# Altium schematic sheet 原理图 .SchDoc
size A4
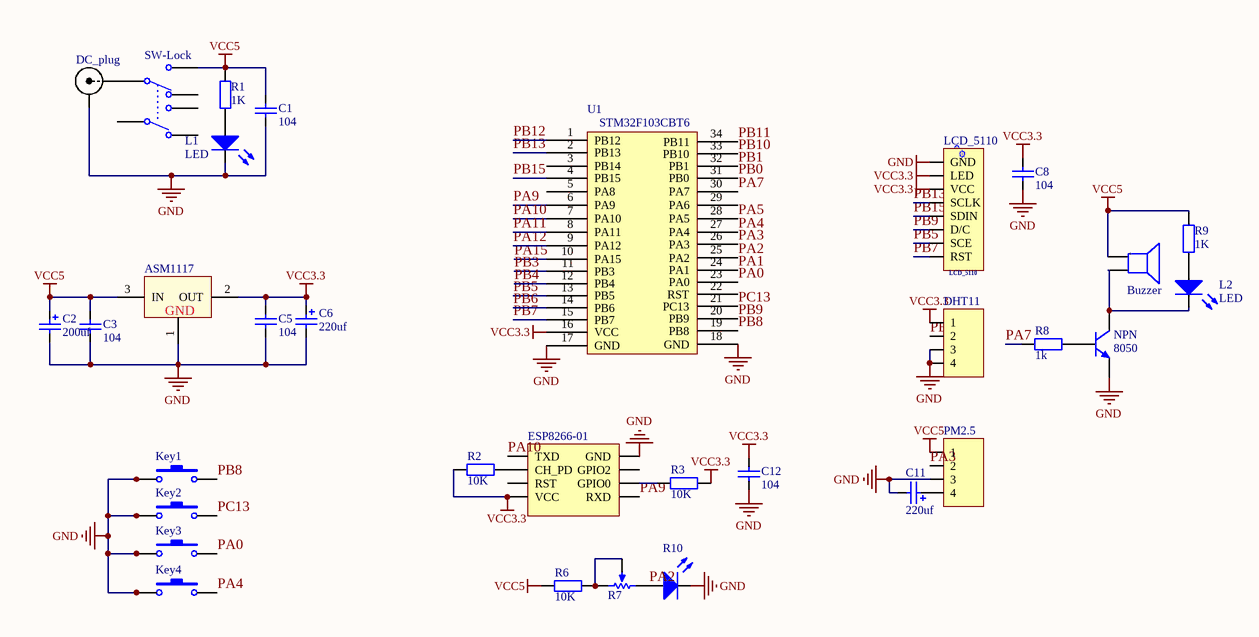
[diagram p0: 原理图 .SchDoc]

## Parts
ASM1117  (no value)  [ASM1117]
Buzzer  (no value)  [Buzzer]
C1  104  [CAP_ceramic_1*0.8]
C2  200uf  [CAP_elect_1*2]
C3  104  [CAP_ceramic_1*0.8]
C5  104  [CAP_ceramic_1*0.8]
C6  220uf  [CAP_elect_1*2]
C8  104  [CAP_ceramic_1*0.8]
C11  220uf  [CAP_elect_2*2]
C12  104  [CAP_ceramic_1*0.8]
DC_plug  (no value)  [DC_plug]
DHT11  (no value)  [PIN_4]
ESP8266-01  (no value)  [ESP8266-01]
Key1  (no value)  [KEY_1]
Key2  (no value)  [KEY_1]
Key3  (no value)  [KEY_1]
Key4  (no value)  [KEY_1]
L1  LED  [LED_R]
L2  LED  [LED_R]
LCD_5110  (no value)  [LCD_5110]
NPN  8050  [NPN/PNP_DIP_1]
PM2.5  (no value)  [PIN_4]
R1  1K  [RES_TOR_0.4]
R2  10K  [RES_TOR_0.4]
R3  10K  [RES_TOR_0.4]
R6  10K  [RES_TOR_0.4]
R7  (no value)  [RES_POT_1]
R8  1k  [RES_TOR_0.4]
R9  1K  [RES_TOR_0.4]
R10  (no value)  [LED_R]
SW-Lock  (no value)  [SW-LOCK]
U1  STM32F103CBT6最小系统  [STM32F103CBT6]  (value not drawn)

## Nets
GND: ASM1117.1(GND) C1.1 C2.2 C3.1 C5.2 C6.2 C8.1 C11.2 C12.1 DC_plug.2(GND) DHT11.3 DHT11.4 ESP8266-01.8(GND) Key1.1 Key1.3 Key2.1 Key2.3 Key3.1 Key3.3 Key4.1 Key4.3 L1.2(K) LCD_5110.1(GND) NPN.1(E) PM2.5.3 R10.2(K) U1.17(GND) U1.18(GND)
VCC3.3: ASM1117.2(OUT) C5.1 C6.1 C8.2 C12.2 DHT11.1 ESP8266-01.4(VCC) LCD_5110.2(LED) LCD_5110.3(VCC) R2.1 R3.2 U1.16(VCC)
VCC5: ASM1117.3(IN) Buzzer.1 C1.2 C2.1 C3.2 PM2.5.1 R1.2 R6.1 R9.2 SW-Lock.5
PA0: Key3.2 Key3.4 U1.23(PA0)
PA1: U1.24(PA1)
PA2: R7.3 R10.1(A) U1.25(PA2)
PA3: PM2.5.2 U1.26(PA3)
PA4: Key4.2 Key4.4 U1.27(PA4)
PA5: U1.28(PA5)
PA7: R8.1 U1.30(PA7)
PA9: ESP8266-01.5(RXD) U1.6(PA9)
PA10: ESP8266-01.1(TXD) U1.7(PA10)
PA11: U1.8(PA11)
PA12: U1.9(PA12)
PA15: U1.10(PA15)
PB0: U1.31(PB0)
PB1: U1.32(PB1)
PB3: U1.11(PB3)
PB4: U1.12(PB4)
PB5: LCD_5110.7(SCE) U1.13(PB5)
PB6: U1.14(PB6)
PB7: LCD_5110.8(RST) U1.15(PB7)
PB8: Key1.2 Key1.4 U1.19(PB8)
PB9: LCD_5110.6(D/C) U1.20(PB9)
PB10: U1.33(PB10)
PB11: U1.34(PB11)
PB12: DHT11.2 U1.1(PB12)
PB13: LCD_5110.4(SCLK) U1.2(PB13)
PB15: LCD_5110.5(SDIN) U1.4(PB15)
PC13: Key2.2 Key2.4 U1.21(PC13)
NetBuzzer_2: Buzzer.2 L2.2(K) NPN.3(C)
NetC11_1: C11.1 PM2.5.4
NetDC_plug_1: DC_plug.1(VCC) SW-Lock.6
NetESP8266-01_2: ESP8266-01.2(CH_PD) R2.2
NetESP8266-01_6: ESP8266-01.6(GPIO0) R3.1
NetL1_1: L1.1(A) R1.1
NetL2_1: L2.1(A) R9.1
NetNPN_2: NPN.2(B) R8.2
NetR6_2: R6.2 R7.1 R7.2

Not connected (* = marked no-connect by the designer): ESP8266-01 3(RST) 7(GPIO2); SW-Lock 1 2 3 4; U1 3(PB14) 5(PA8) 22(RST) 29(PA6)

## Notes on the sheet
- (in symbol Buzzer) +
- (in symbol STM32F103CBT6最小系统) STM32F103CBT6

## Library data of the parts
ASM1117 = ASM1117
Buzzer = Buzzer
C1 C3 C5 C8 C12 = Cap_ceramic
C2 C6 C11 = Cap_elect_1
DC_plug = DC_plug
DHT11 PM2.5 = PIN_4
ESP8266-01 = ESP8266-01
Key1-Key4 = Key
LCD_5110 = LCD_5110
NPN = NPN
R1-R3 R6 R8 R9 = Res1
R7 = Res_pot
R10 = LED
SW-Lock = SW-Lock